# Altium schematic sheet Schematic.SchDoc
size A3; SheetNumber: 1; SheetTotal: 1
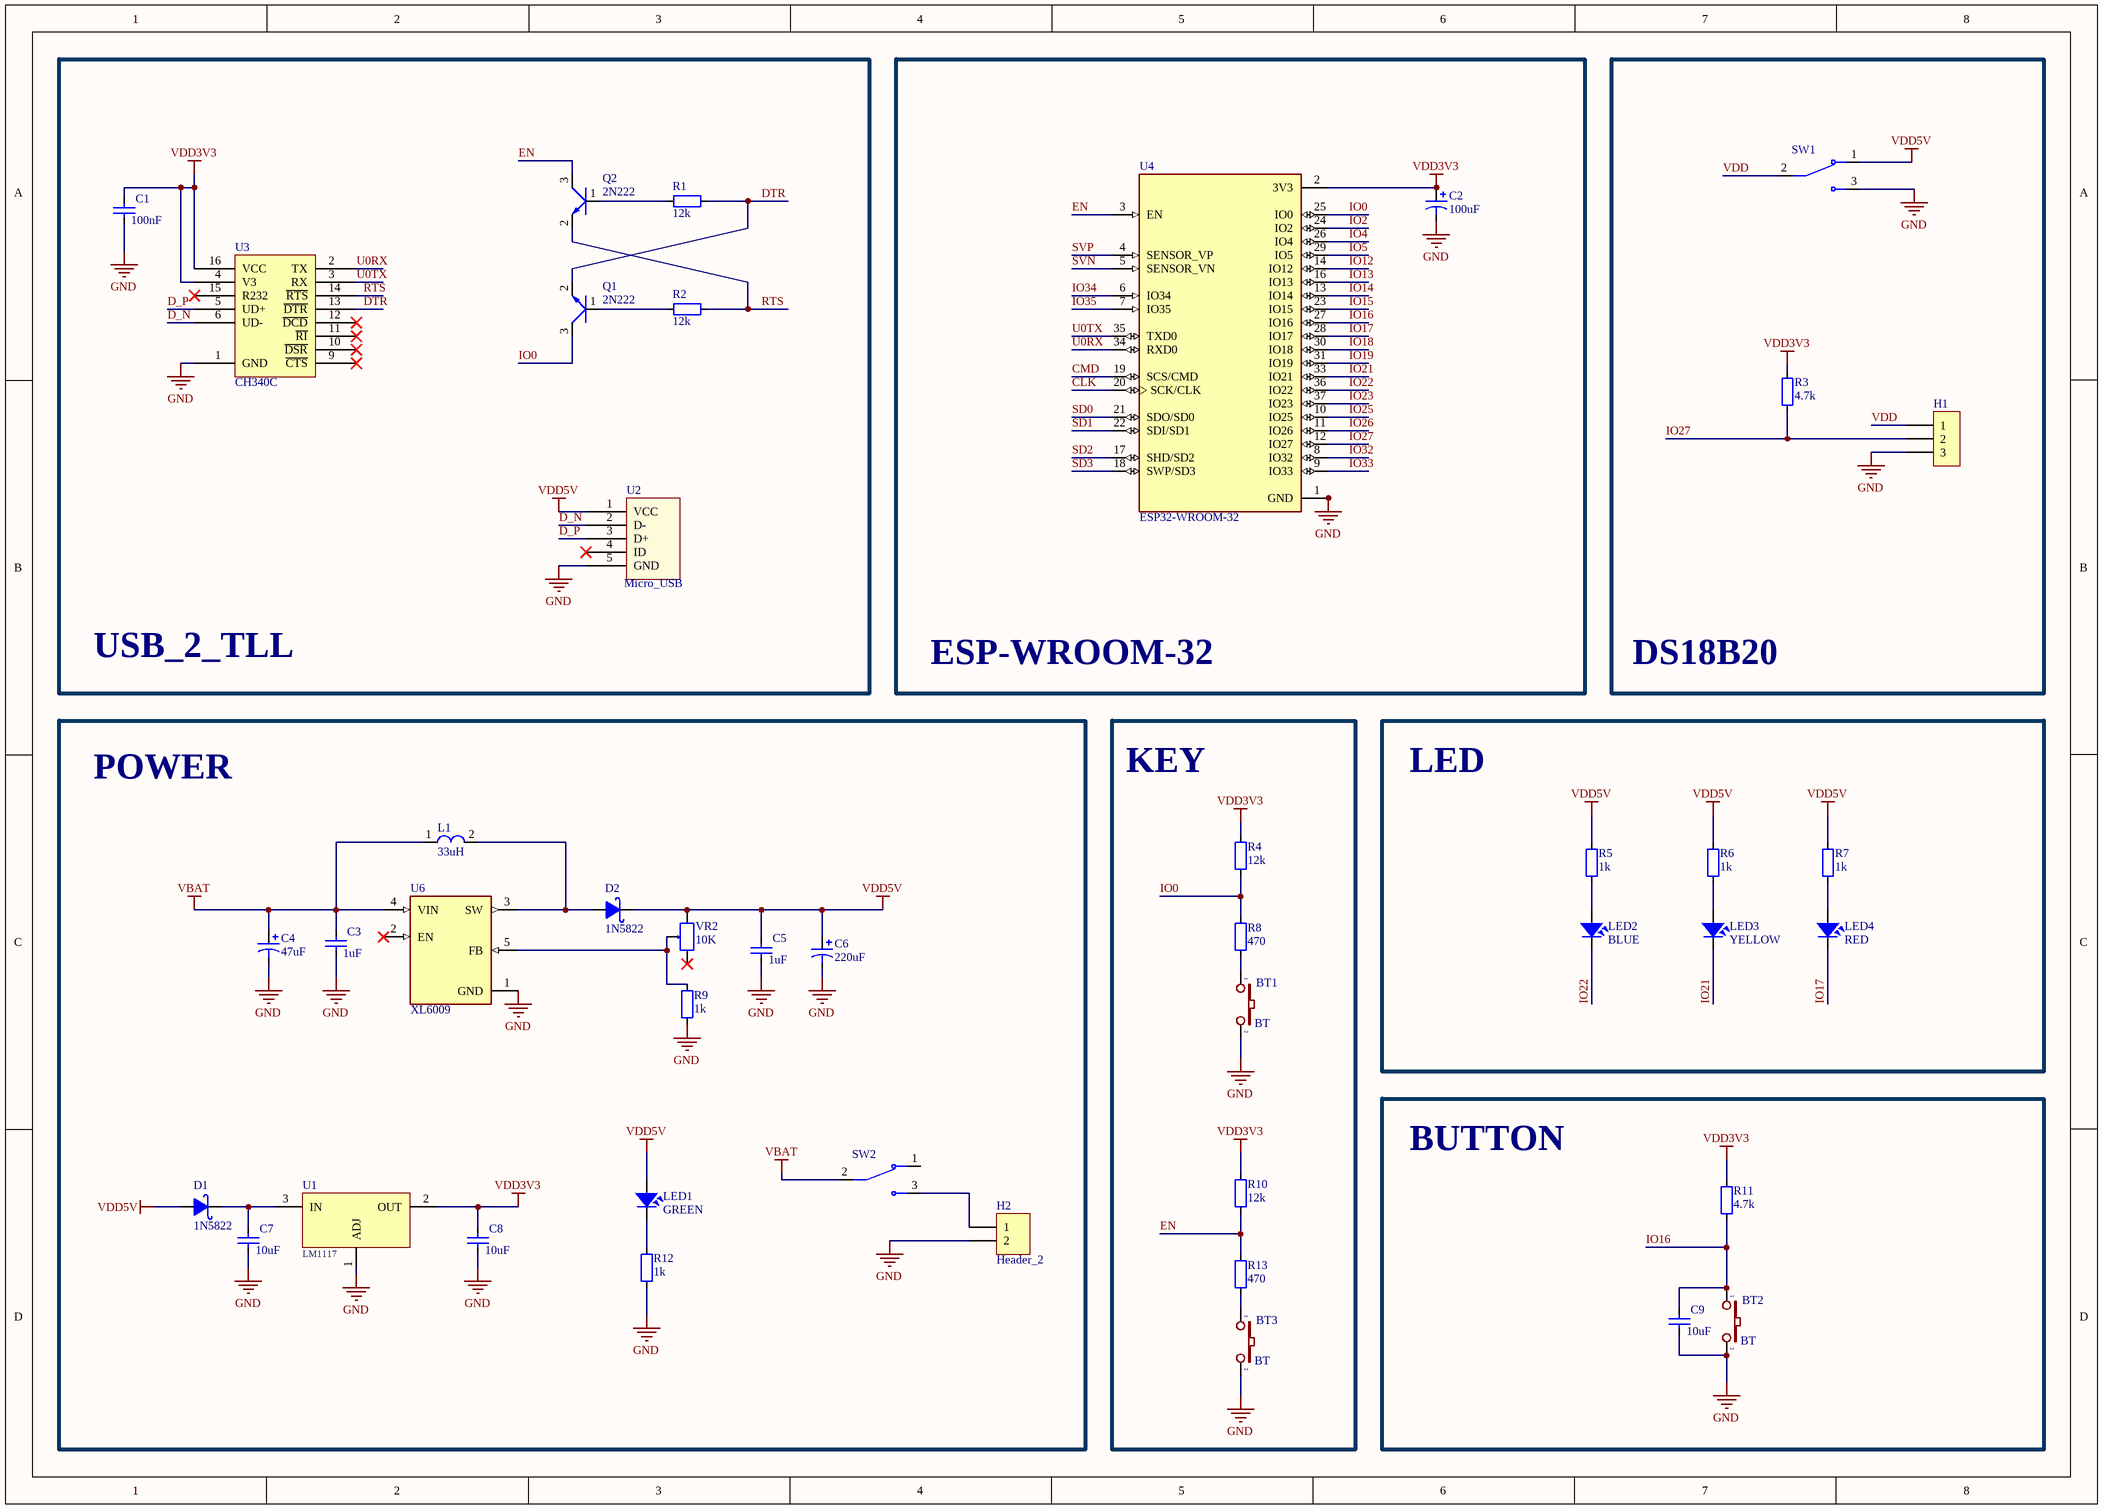
[diagram p0: Schematic.SchDoc]

## Parts
BT1  BT  [BUTTON 4 PIN]
BT2  BT  [BUTTON 4 PIN]
BT3  BT  [BUTTON 4 PIN]
C1  100nF  [CAP_0805]
C2  100uF  [C5mm]
C3  1uF  [CAP_0805]
C4  47uF  [C3MM]
C5  1uF  [CAP_0805]
C6  220uF  [C5mm]
C7  10uF  [CAP_0805]
C8  10uF  [CAP_0805]
C9  10uF  [CAP_0805]
D1  1N5822  [DIO-SMD-123]
D2  1N5822  [DIO-SMD-123]
H1  Header_3  [KF3-5.08]  (value not drawn)
H2  Header_2  [KF2-5.08]
L1  33uH  [L-SMD-M-7.3x4.5]
LED1  GREEN  [LED_GREEN_3MM]
LED2  BLUE  [LED_BLUE_3MM]
LED3  YELLOW  [LED_YELLOW_3MM]
LED4  RED  [LED_RED_3MM]
Q1  2N222  [SOT23D]
Q2  2N222  [SOT23D]
R1  12k  [RES-SMD-0805]
R2  12k  [RES-SMD-0805]
R3  4.7k  [RES-SMD-0805]
R4  12k  [RES-SMD-0805]
R5  1k  [RES-SMD-0805]
R6  1k  [RES-SMD-0805]
R7  1k  [RES-SMD-0805]
R8  470  [RES-SMD-0805]
R9  1k  [RES-SMD-0805]
R10  12k  [RES-SMD-0805]
R11  4.7k  [RES-SMD-0805]
R12  1k  [RES-SMD-0805]
R13  470  [RES-SMD-0805]
SW1  500SSP1S2M2QEA  [3pin]  (value not drawn)
SW2  500SSP1S2M2QEA  [3pin]  (value not drawn)
U1  LM1117  [LM1117-SOP]
U2  Micro_USB  [AMPHENOL_10118194-0001LF]
U3  CH340C  [SO016]
U4  ESP32-WROOM-32  [MODULE_ESP32-WROOM-32]
U6  XL6009  [DPAK170P1435X465-6N]
VR2  10K  [VR]

## Blocks framed on the sheet
USB_2_TLL: C1 Q1 Q2 R1 R2 U2 U3
ESP-WROOM-32: C2 U4
DS18B20: H1 R3 SW1
POWER: C3-C8 D1 D2 H2 L1 LED1 R9 R12 SW2 U1 U6 VR2
KEY: BT1 BT3 R4 R8 R10 R13
LED: LED2-LED4 R5-R7
BUTTON: BT2 C9 R11

## Nets
GND: BT1.2 BT2.2 BT3.2 C1.1 C2.2 C3.1 C4.2 C5.1 C6.2 C7.1 C8.1 C9.1 H1.3 H2.2 R9.1 R12.1 SW1.3(NO) U1.1(ADJ) U2.5(GND) U3.1(GND) U4.1(GND) U4.15(GND) U4.38(GND) U4.39_1(GND) U4.39_2(GND) U4.39_3(GND) U4.39_4(GND) U4.39_5(GND) U4.39_6(GND) U4.39_7(GND) U4.39_8(GND) U4.39_9(GND) U4.39_10(GND) U4.39_11(GND) U4.39_12(GND) U4.39_13(GND) U4.39_14(GND) U4.39_15(GND) U4.39_16(GND) U4.39_17(GND) U4.39_18(GND) U4.39_19(GND) U4.39_20(GND) U4.39_21(GND) U6.1(GND)
VBAT: C3.2 C4.1 L1.1 SW2.2(COM) U6.4(VIN)
VDD3V3: C1.2 C2.1 C8.2 R3.2 R4.2 R10.2 R11.2 U1.2(OUT) U3.4(V3) U3.16(VCC) U4.2(3V3)
VDD5V: C5.2 C6.1 D1.1(A) D2.2(K) LED1.1 R5.2 R6.2 R7.2 SW1.1(NC) U2.1(VCC) VR2.3
CLK: U4.20(SCK/CLK)
CMD: U4.19(SCS/CMD)
D_N: U2.2(D-) U3.6(UD-)
D_P: U2.3(D+) U3.5(UD+)
DTR: Q1.2(E) R1.2 U3.13(~{DTR})
EN: Q2.3(C) R10.1 R13.2 U4.3(EN)
IO0: Q1.3(C) R4.1 R8.2 U4.25(IO0)
IO2: U4.24(IO2)
IO4: U4.26(IO4)
IO5: U4.29(IO5)
IO12: U4.14(IO12)
IO13: U4.16(IO13)
IO14: U4.13(IO14)
IO15: U4.23(IO15)
IO16: BT2.1 C9.2 R11.1 U4.27(IO16)
IO17: LED4.2 U4.28(IO17)
IO18: U4.30(IO18)
IO19: U4.31(IO19)
IO21: LED3.2 U4.33(IO21)
IO22: LED2.2 U4.36(IO22)
IO23: U4.37(IO23)
IO25: U4.10(IO25)
IO26: U4.11(IO26)
IO27: H1.2 R3.1 U4.12(IO27)
IO32: U4.8(IO32)
IO33: U4.9(IO33)
IO34: U4.6(IO34)
IO35: U4.7(IO35)
RTS: Q2.2(E) R2.2 U3.14(~{RTS})
SD0: U4.21(SDO/SD0)
SD1: U4.22(SDI/SD1)
SD2: U4.17(SHD/SD2)
SD3: U4.18(SWP/SD3)
SVN: U4.5(SENSOR_VN)
SVP: U4.4(SENSOR_VP)
U0RX: U3.2(TX) U4.34(RXD0)
U0TX: U3.3(RX) U4.35(TXD0)
VDD: H1.1 SW1.2(COM)
NetBT1_1: BT1.1 R8.1
NetBT3_1: BT3.1 R13.1
NetC7_2: C7.2 D1.2(K) U1.3(IN)
NetD2_1: D2.1(A) L1.2 U6.3(SW)
NetH2_1: H2.1 SW2.3(NO)
NetLED1_2: LED1.2 R12.2
NetLED2_1: LED2.1 R5.1
NetLED3_1: LED3.1 R6.1
NetLED4_1: LED4.1 R7.1
NetQ1_1: Q1.1(B) R2.1
NetQ2_1: Q2.1(B) R1.1
NetR9_2: R9.2 U6.5(FB) VR2.2

Not connected (* = marked no-connect by the designer): SW2 1(NC); U2 4(ID)*; U3 9(~{CTS})* 10(~{DSR})* 11(~{RI})* 12(~{DCD})* 15(R232)*; U6 2(EN)*; VR2 1*

## Library data of the parts
BT1-BT3 = SW2: Switch button 2 pin; Value: SW chip 2 pin
C1 C3 C5 C7-C9 = CapSMD: Capacitor; Value: 33p; Published: 8-Jun-2000; LatestRevisionDate: 17-Jul-2002; LatestRevisionNote: Re-released for DXP Platform.; PackageReference: RAD-0.3; Publisher: Altium Limited
C2 C4 C6 = Cap Pol: Polarized Capacitor (Axial); Published: 8-Jun-2000; LatestRevisionDate: 17-Jul-2002; LatestRevisionNote: Re-released for DXP Platform.; PackageReference: POLAR0.8; Publisher: Altium Limited
D1 D2 = 1N5822: Schottky Rectifiers; Value: Diode c?m 1N5408
H1 = KF3: Manufacturer: Würth Elektronik eiSos GmbH; partNo: 691103110003; ComponentLink1 Description: Manufacturer; ComponentLink2 Description: Datasheet; NoPins: 3; Created Date: 29 October 2013; ComponentLink1URL: http://www.we-online.com; ComponentLink2URL: http://katalog.we-online.de/em/datasheet/6911031100xx.pdf; Created by: Karrer Zheng
H2 = KF2: Manufacturer: Würth Elektronik eiSos GmbH; partNo: 691103110002; ComponentLink1 Description: Manufacturer; ComponentLink2 Description: Datasheet; NoPins: 2; Created Date: 29 October 2013; ComponentLink1URL: http://www.we-online.com; ComponentLink2URL: http://katalog.we-online.de/em/datasheet/6911031100xx.pdf; Created by: Karrer Zheng
L1 = L-SMD-1: partNo: 78477010; Manufacturer: Wurth Elektronik; Inductance: 1.0 μH; ComponentLink1Description: Manufacturer; ComponentLink1URL: http://www.we-online.de; Created by: Baojun Chen; Created Date: Nov.2015; ComponentLink2Description: Datasheet; ComponentLink2URL: http://katalog.we-online.de/pbs/datasheet/78477010.pdf
LED1-LED4 = LED: LED Single colour Green and Red; Value: LED 3 ly Single Colour
Q1 Q2 = 2N222: NPN 600mW, ECB; Value: C1815
R1-R13 = Resistor - SMD: Resistor; Manufacturer: Generic Components; Class: Passive; Published: 08/06/2000; Publisher: Altium Hobart Technology Centre
SW1 SW2 = 500SSP1S2M2QEA: Slide Switch SPDT Through Hole; Package: None; Availability: Unavailable; Value: *; MP: 500SSP1S2M2QEA; Price: None
U1 = LM1117-ADJ: 800mA Low-Dropout Linear Regulator; Creator: Nguyen Ba Bien; Website: http://group3i.net
U3 = CH340C: USB to serial chip CH340; MF: WCH; Package: Package; Check_prices: https://www.snapeda.com/parts/CH340C/WCH/view-part/5428851/?ref=eda; Value: *; Price: None; MP: CH340C; Availability: Unavailable; SnapEDA_Link: https://www.snapeda.com/parts/CH340C/WCH/view-part/5428851/?ref=snap
U4 = ESP32-WROOM-32: Bluetooth, WiFi Transceiver Module 2.4GHz ~ 2.5GHz Surface Mount; MF: Espressif Systems; Package: Module Espressif Systems; Digi-Key_Part_Number: 1904-1010-1-ND; Digi-Key_Purchase_URL: https://www.digikey.com/product-detail/en/espressif-systems/ESP32-WROOM-32/1904-1010-1-ND/8544305?utm_source=snapeda&utm_medium=aggregator&utm_campaign=symbol; Value: *; MP: ESP32-WROOM-32; SnapEDA_Link: https://www.snapeda.com/parts/ESP32-WROOM-32/Espressif%20Systems/view-part/2753322/?ref=snap
U6 = XL6009: The XL6009 regulator is a wide input range, current mode, DC/DC converter which is capable of generating either positive or negative output voltages.; Package: None; Availability: Unavailable; Value: *; MP: XL6009; Price: None
VR2 = VR: Var Resistor; Value: VR 10K